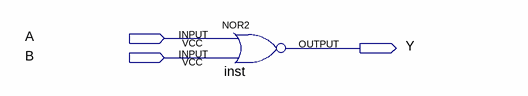
[diagram p0: schematic sheet]
// Quartus schematic CONG_NOR.bdf as structural Verilog: 1 symbols, 3 pins
module CONG_NOR (
  input  A,
  input  B,
  output Y
);

  nor inst (Y, A, B);
endmodule
